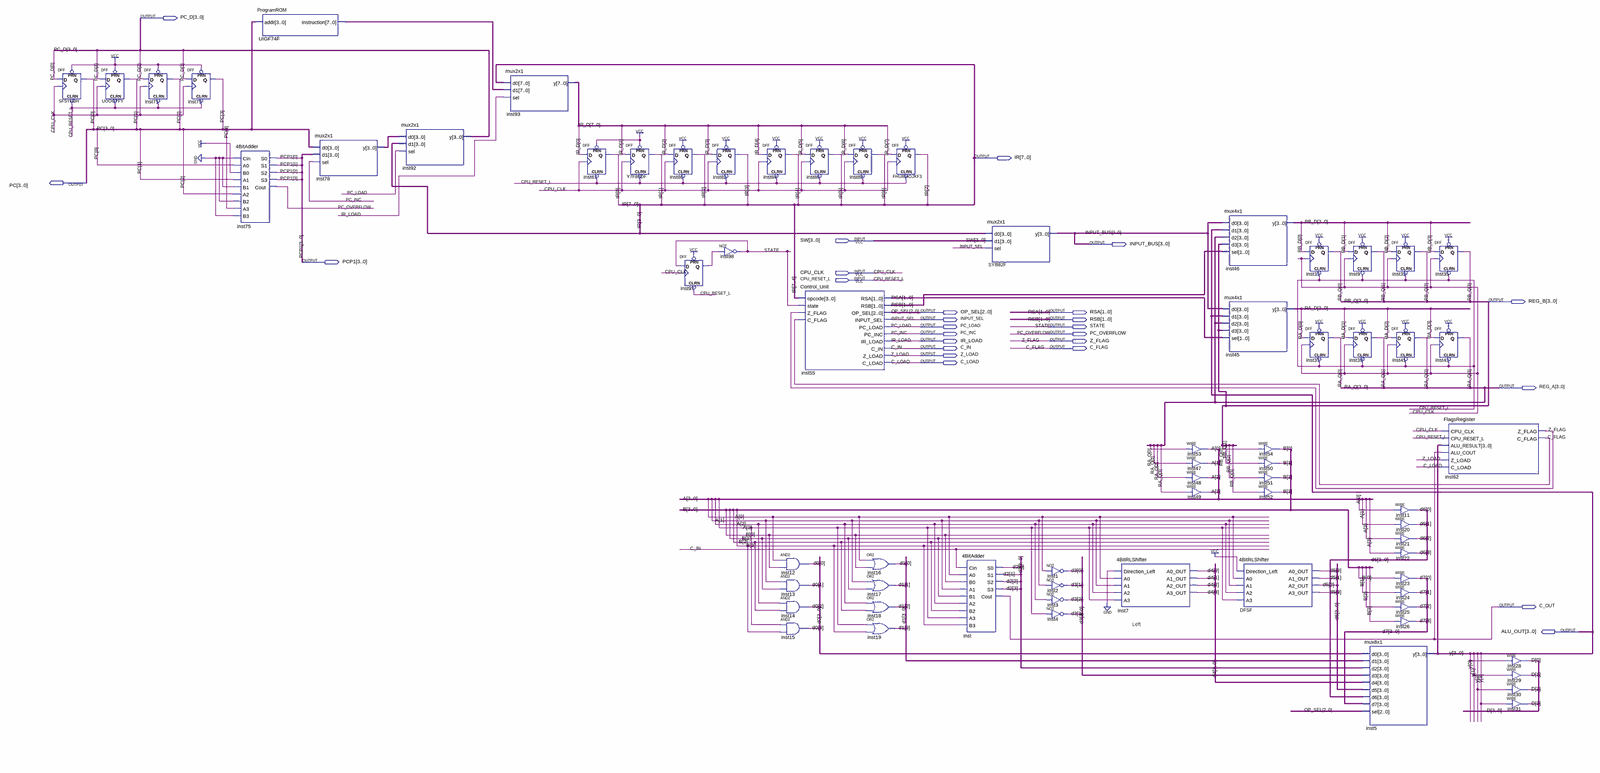
[diagram p0: schematic sheet, whole]
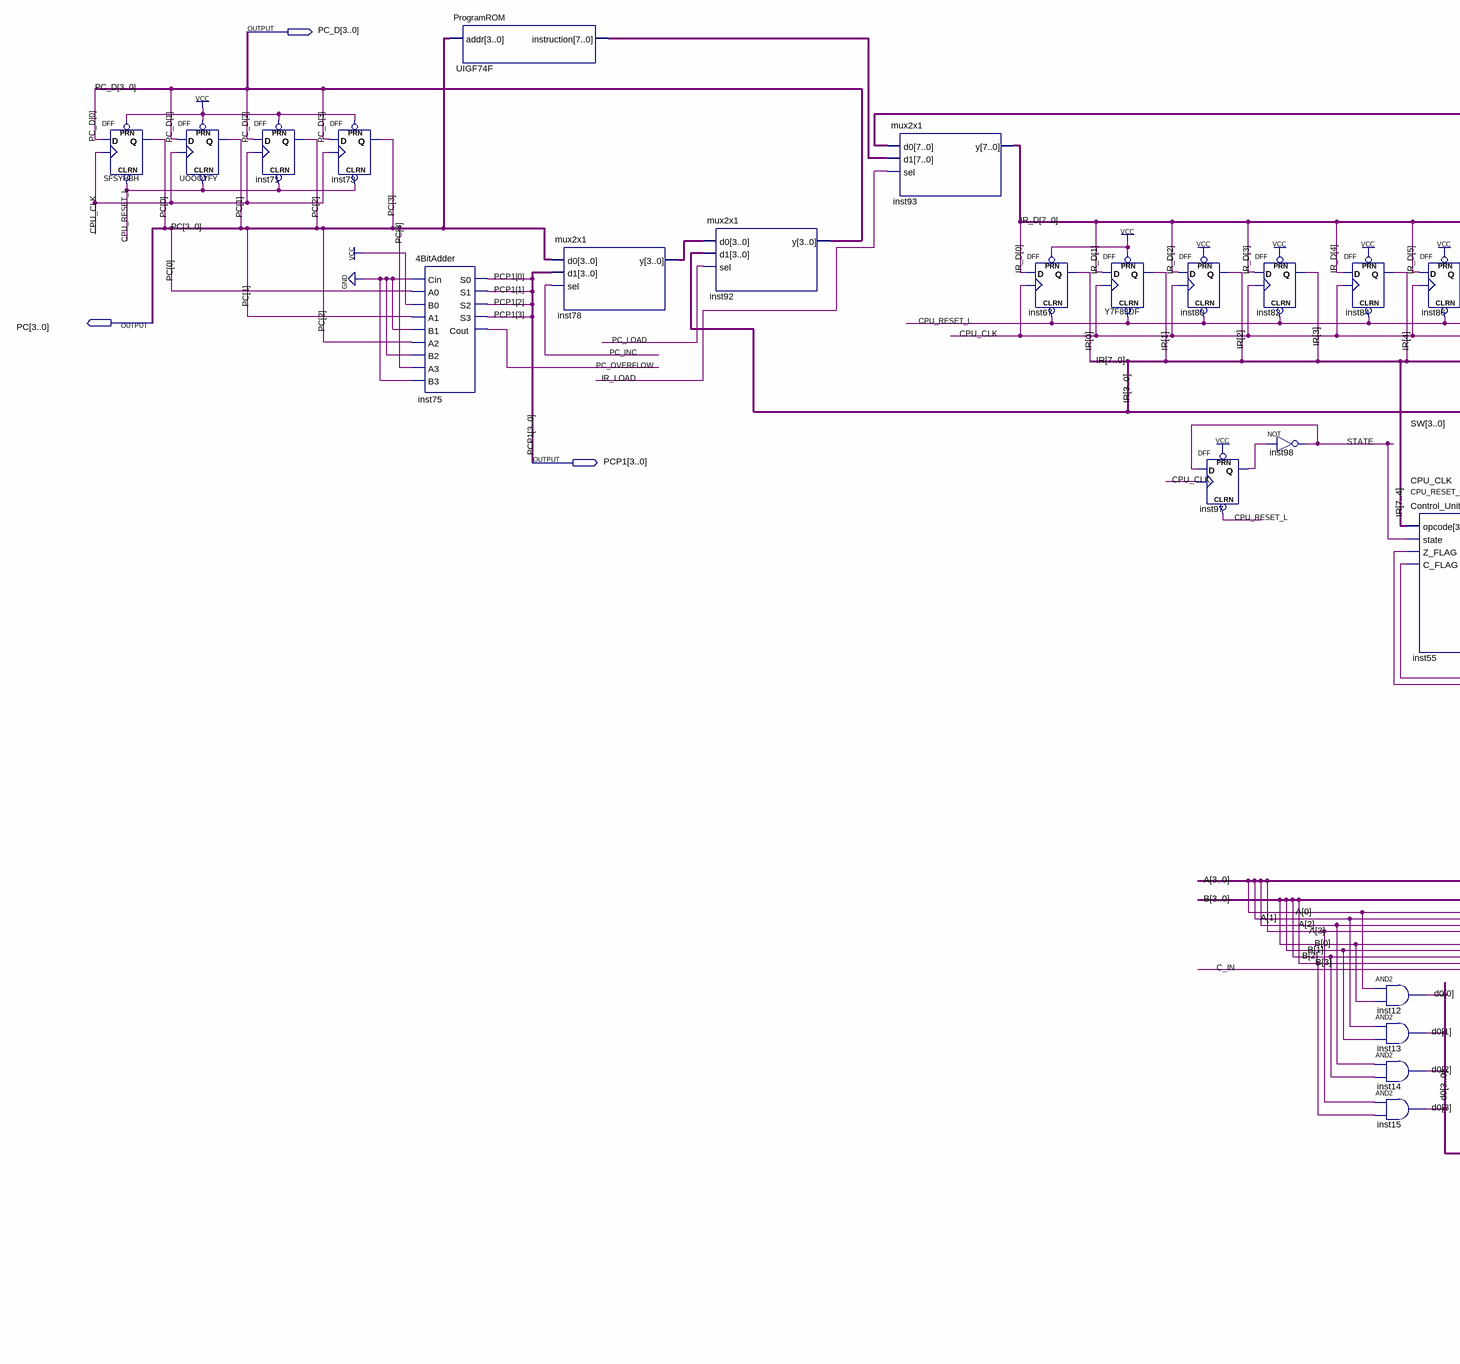
[diagram p1: schematic sheet, left part]
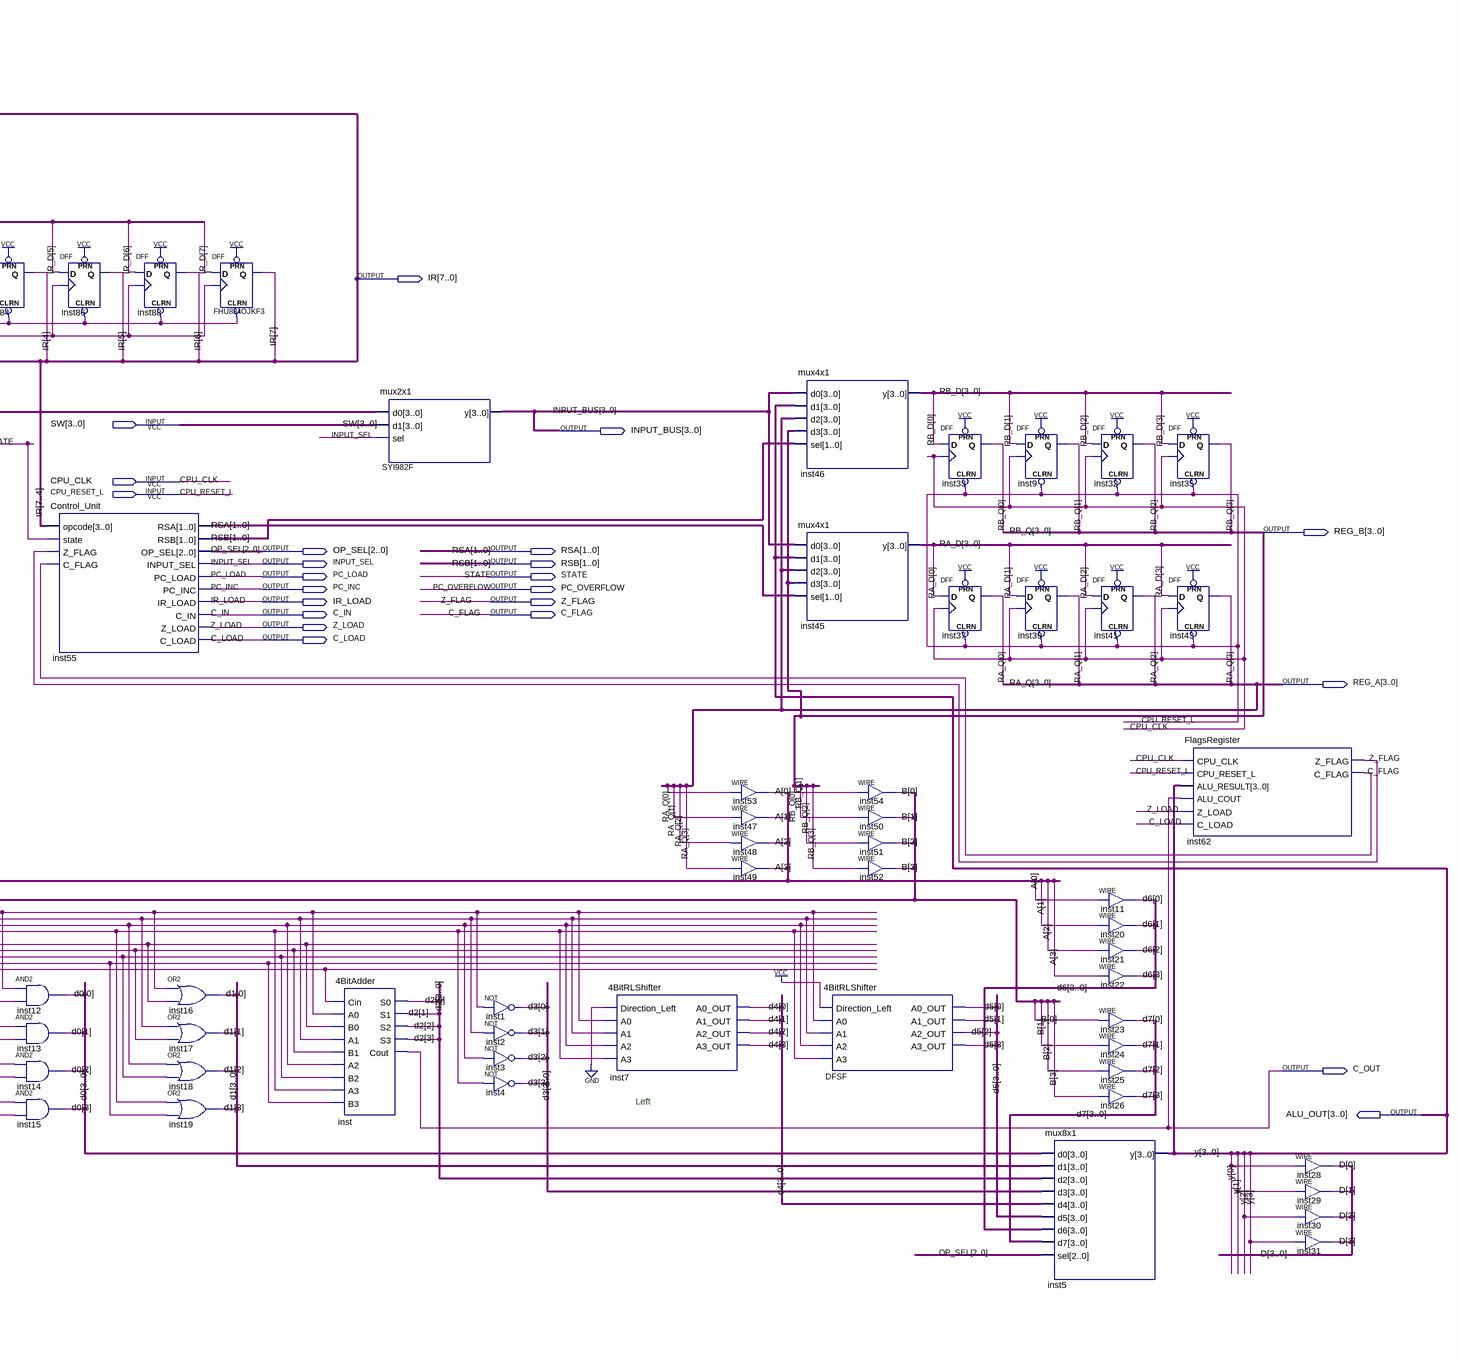
[diagram p2: schematic sheet, right part]
// Quartus schematic CPU.bdf as structural Verilog: 68 symbols, 26 pins
module CPU (
  input  [3:0] SW,
  input  CPU_CLK,
  input  CPU_RESET_L,
  output [3:0] PC_D,
  output [7:0] IR,
  output [3:0] PC,
  output [3:0] INPUT_BUS,
  output [3:0] PCP1,
  output [3:0] REG_B,
  output [2:0] OP_SEL,
  output [1:0] RSA,
  output INPUT_SEL,
  output [1:0] RSB,
  output PC_LOAD,
  output STATE,
  output PC_INC,
  output PC_OVERFLOW,
  output IR_LOAD,
  output Z_FLAG,
  output C_IN,
  output C_FLAG,
  output Z_LOAD,
  output C_LOAD,
  output [3:0] REG_A,
  output C_OUT,
  output [3:0] ALU_OUT
);

  wire inst97_q;
  wire [3:0] A, B, D, d0, d1, d2, d3, d4, d5, d6, d7, inst78_y, RA_D, RB_D;
  wire [7:0] IR_D, UIGF74F_instruction;

  DFF SFSYHBH (.CLRN(CPU_RESET_L), .CLK(CPU_CLK), .D(PC_D[0]), .PRN(1'b1), .Q(PC[0]));
  DFF UOOOYFY (.CLRN(CPU_RESET_L), .CLK(CPU_CLK), .D(PC_D[1]), .PRN(1'b1), .Q(PC[1]));
  DFF inst71 (.CLRN(CPU_RESET_L), .CLK(CPU_CLK), .D(PC_D[2]), .PRN(1'b1), .Q(PC[2]));
  DFF inst73 (.CLRN(CPU_RESET_L), .CLK(CPU_CLK), .D(PC_D[3]), .PRN(1'b1), .Q(PC[3]));
  \4BitAdder  inst75 (
    .Cin(1'b0), .A0(PC[0]), .B0(1'b1), .A1(PC[1]), .B1(1'b0), .A2(PC[2]), .B2(1'b0), .A3(PC[3]), .B3(1'b0),
    .S0(PCP1[0]), .S1(PCP1[1]), .S2(PCP1[2]), .S3(PCP1[3]), .Cout(PC_OVERFLOW));
  ProgramROM UIGF74F (.addr(PC), .instruction(UIGF74F_instruction));
  mux2x1 inst78 (.d0(PC), .d1(PCP1), .sel(PC_INC), .y(inst78_y));
  mux2x1 inst92 (.d0(inst78_y), .d1(IR[3:0]), .sel(PC_LOAD), .y(PC_D));
  mux2x1 inst93 (.d0(IR), .d1(UIGF74F_instruction), .sel(IR_LOAD), .y(IR_D));
  DFF inst67 (.CLRN(CPU_RESET_L), .CLK(CPU_CLK), .D(IR_D[0]), .PRN(1'b1), .Q(IR[0]));
  DFF Y7F83DF (.CLRN(CPU_RESET_L), .CLK(CPU_CLK), .D(IR_D[1]), .PRN(1'b1), .Q(IR[1]));
  DFF inst80 (.CLRN(CPU_RESET_L), .CLK(CPU_CLK), .D(IR_D[2]), .PRN(1'b1), .Q(IR[2]));
  DFF inst97 (.CLRN(CPU_RESET_L), .CLK(CPU_CLK), .D(STATE), .PRN(1'b1), .Q(inst97_q));
  DFF inst82 (.CLRN(CPU_RESET_L), .CLK(CPU_CLK), .D(IR_D[3]), .PRN(1'b1), .Q(IR[3]));
  not inst98 (STATE, inst97_q);
  DFF inst84 (.CLRN(CPU_RESET_L), .CLK(CPU_CLK), .D(IR_D[4]), .PRN(1'b1), .Q(IR[4]));
  and inst12 (d0[0], A[0], B[0]);
  and inst13 (d0[1], A[1], B[1]);
  and inst14 (d0[2], A[2], B[2]);
  and inst15 (d0[3], A[3], B[3]);
  DFF inst86 (.CLRN(CPU_RESET_L), .CLK(CPU_CLK), .D(IR_D[5]), .PRN(1'b1), .Q(IR[5]));
  Control_Unit inst55 (
    .opcode(IR[7:4]), .state(STATE), .Z_FLAG(Z_FLAG), .C_FLAG(C_FLAG), .RSA(RSA), .RSB(RSB), .OP_SEL(OP_SEL),
    .INPUT_SEL(INPUT_SEL), .PC_LOAD(PC_LOAD), .PC_INC(PC_INC), .IR_LOAD(IR_LOAD), .C_IN(C_IN),
    .Z_LOAD(Z_LOAD), .C_LOAD(C_LOAD));
  DFF inst88 (.CLRN(CPU_RESET_L), .CLK(CPU_CLK), .D(IR_D[6]), .PRN(1'b1), .Q(IR[6]));
  or inst16 (d1[0], A[0], B[0]);
  or inst17 (d1[1], A[1], B[1]);
  or inst18 (d1[2], A[2], B[2]);
  or inst19 (d1[3], A[3], B[3]);
  DFF FHU834OJKF3 (.CLRN(CPU_RESET_L), .CLK(CPU_CLK), .D(IR_D[7]), .PRN(1'b1), .Q(IR[7]));
  \4BitAdder  inst (
    .Cin(C_IN), .A0(A[0]), .B0(B[0]), .A1(A[1]), .B1(B[1]), .A2(A[2]), .B2(B[2]), .A3(A[3]), .B3(B[3]),
    .S0(d2[0]), .S1(d2[1]), .S2(d2[2]), .S3(d2[3]), .Cout(C_OUT));
  mux2x1 SYI982F (.d0(IR[3:0]), .d1(SW), .sel(INPUT_SEL), .y(INPUT_BUS));
  not inst1 (d3[0], A[0]);
  not inst2 (d3[1], A[1]);
  not inst3 (d3[2], A[2]);
  not inst4 (d3[3], A[3]);
  \4BitRLShifter  inst7 (
    .Direction_Left(1'b0), .A0(A[0]), .A1(A[1]), .A2(A[2]), .A3(A[3]), .A0_OUT(d4[0]), .A1_OUT(d4[1]),
    .A2_OUT(d4[2]), .A3_OUT(d4[3]));
  assign A[0] = REG_A[0];  // WIRE inst53
  assign A[1] = REG_A[1];  // WIRE inst47
  assign A[2] = REG_A[2];  // WIRE inst48
  assign A[3] = REG_A[3];  // WIRE inst49
  mux4x1 inst46 (.d0(INPUT_BUS), .d1(ALU_OUT), .d2(REG_A), .d3(REG_B), .sel(RSB), .y(RB_D));
  mux4x1 inst45 (.d0(INPUT_BUS), .d1(ALU_OUT), .d2(REG_A), .d3(REG_B), .sel(RSA), .y(RA_D));
  \4BitRLShifter  DFSF (
    .Direction_Left(1'b1), .A0(A[0]), .A1(A[1]), .A2(A[2]), .A3(A[3]), .A0_OUT(d5[0]), .A1_OUT(d5[1]),
    .A2_OUT(d5[2]), .A3_OUT(d5[3]));
  assign B[0] = REG_B[0];  // WIRE inst54
  assign B[1] = REG_B[1];  // WIRE inst50
  assign B[2] = REG_B[2];  // WIRE inst51
  assign B[3] = REG_B[3];  // WIRE inst52
  DFF inst33 (.CLRN(CPU_RESET_L), .CLK(CPU_CLK), .D(RB_D[0]), .PRN(1'b1), .Q(REG_B[0]));
  DFF inst37 (.CLRN(CPU_RESET_L), .CLK(CPU_CLK), .D(RA_D[0]), .PRN(1'b1), .Q(REG_A[0]));
  DFF inst9 (.CLRN(CPU_RESET_L), .CLK(CPU_CLK), .D(RB_D[1]), .PRN(1'b1), .Q(REG_B[1]));
  DFF inst39 (.CLRN(CPU_RESET_L), .CLK(CPU_CLK), .D(RA_D[1]), .PRN(1'b1), .Q(REG_A[1]));
  mux8x1 inst5 (.d0(d0), .d1(d1), .d2(d2), .d3(d3), .d4(d4), .d5(d5), .d6(d6), .d7(d7), .sel(OP_SEL), .y(ALU_OUT));
  DFF inst32 (.CLRN(CPU_RESET_L), .CLK(CPU_CLK), .D(RB_D[2]), .PRN(1'b1), .Q(REG_B[2]));
  DFF inst41 (.CLRN(CPU_RESET_L), .CLK(CPU_CLK), .D(RA_D[2]), .PRN(1'b1), .Q(REG_A[2]));
  assign d6[0] = A[0];  // WIRE inst11
  assign d6[1] = A[1];  // WIRE inst20
  assign d6[2] = A[2];  // WIRE inst21
  assign d6[3] = A[3];  // WIRE inst22
  assign d7[0] = B[0];  // WIRE inst23
  assign d7[1] = B[1];  // WIRE inst24
  assign d7[2] = B[2];  // WIRE inst25
  assign d7[3] = B[3];  // WIRE inst26
  DFF inst35 (.CLRN(CPU_RESET_L), .CLK(CPU_CLK), .D(RB_D[3]), .PRN(1'b1), .Q(REG_B[3]));
  DFF inst43 (.CLRN(CPU_RESET_L), .CLK(CPU_CLK), .D(RA_D[3]), .PRN(1'b1), .Q(REG_A[3]));
  FlagsRegister inst62 (
    .CPU_CLK(CPU_CLK), .CPU_RESET_L(CPU_RESET_L), .ALU_RESULT(ALU_OUT), .ALU_COUT(C_OUT), .Z_LOAD(Z_LOAD),
    .C_LOAD(C_LOAD), .Z_FLAG(Z_FLAG), .C_FLAG(C_FLAG));
  assign D[0] = ALU_OUT[0];  // WIRE inst28
  assign D[1] = ALU_OUT[1];  // WIRE inst29
  assign D[2] = ALU_OUT[2];  // WIRE inst30
  assign D[3] = ALU_OUT[3];  // WIRE inst31

  // Other names for the same wires on the sheet: y[3:0] = ALU_OUT; RA_Q[3:0] = REG_A; RB_Q[3:0] = REG_B

  // Notes on the sheet:
  //   Left
endmodule
